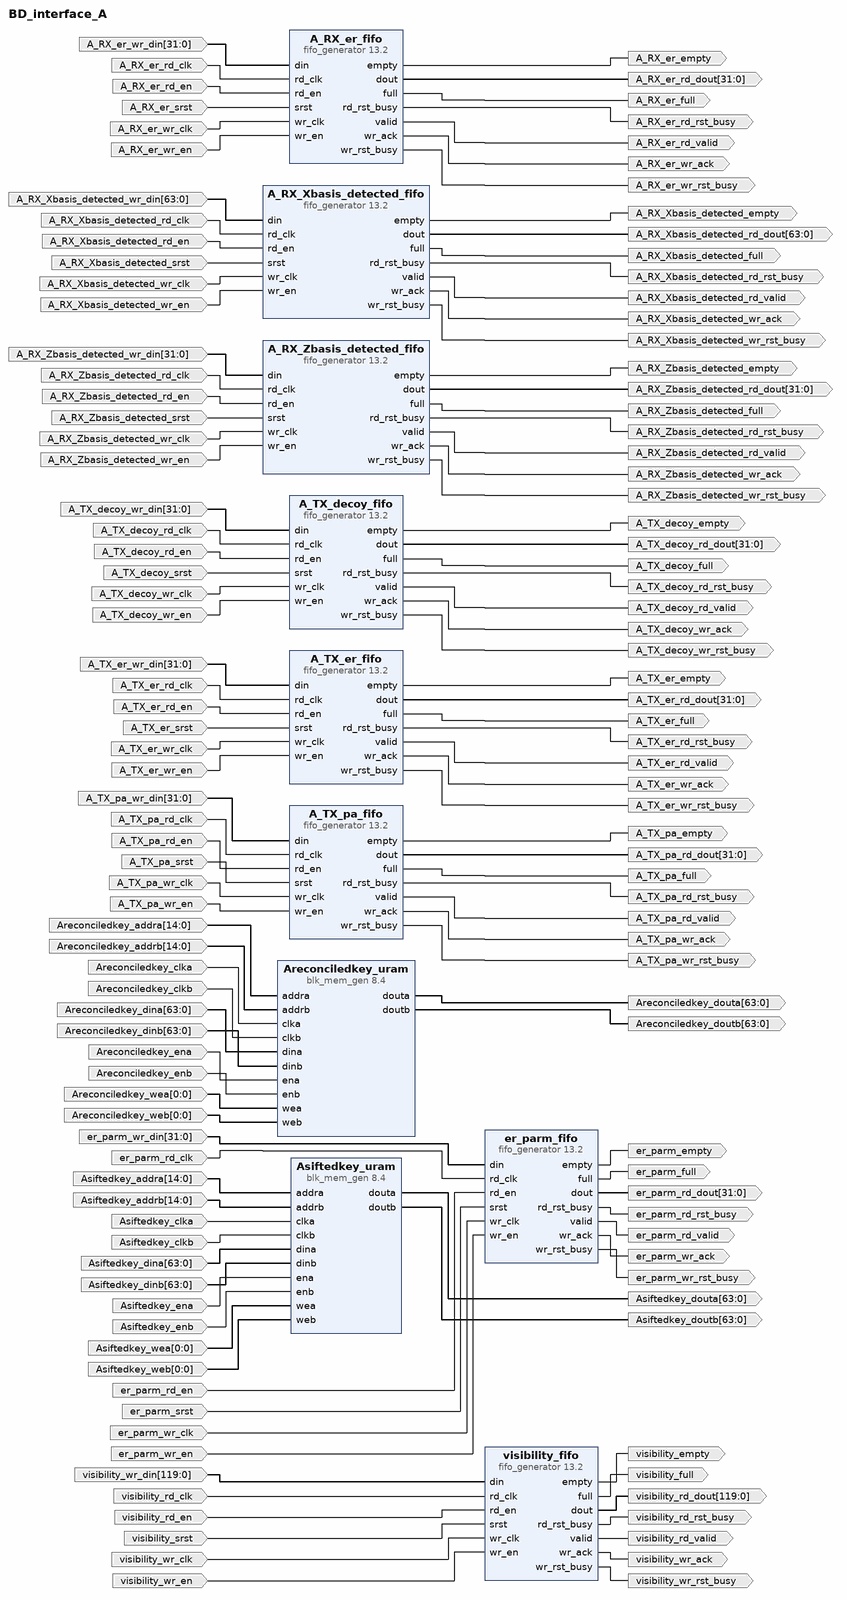
[diagram p0: block diagram of the top level]
# Vivado block design BD_interface_A, xcku5p-ffvb676-2-e, Vivado 2022.1
create_bd_design BD_interface_A

create_bd_port -dir I -type clk A_RX_Xbasis_detected_rd_clk
create_bd_port -dir O A_RX_Xbasis_detected_rd_rst_busy
create_bd_port -dir I A_RX_Xbasis_detected_srst
create_bd_port -dir O A_RX_Xbasis_detected_rd_valid
create_bd_port -dir O A_RX_Xbasis_detected_wr_ack
create_bd_port -dir I -type clk A_RX_Xbasis_detected_wr_clk
create_bd_port -dir O A_RX_Xbasis_detected_wr_rst_busy
create_bd_port -dir O A_RX_Xbasis_detected_full
create_bd_port -dir I A_RX_Xbasis_detected_wr_en
create_bd_port -dir I -from 63 -to 0 A_RX_Xbasis_detected_wr_din
create_bd_port -dir O A_RX_Xbasis_detected_empty
create_bd_port -dir O -from 63 -to 0 A_RX_Xbasis_detected_rd_dout
create_bd_port -dir I A_RX_Xbasis_detected_rd_en
create_bd_port -dir O A_RX_Zbasis_detected_rd_valid
create_bd_port -dir O A_RX_Zbasis_detected_full
create_bd_port -dir I -from 31 -to 0 A_RX_Zbasis_detected_wr_din
create_bd_port -dir O A_RX_Zbasis_detected_wr_rst_busy
create_bd_port -dir O A_RX_Zbasis_detected_rd_rst_busy
create_bd_port -dir I A_RX_Zbasis_detected_wr_en
create_bd_port -dir I A_RX_Zbasis_detected_srst
create_bd_port -dir I -type clk A_RX_Zbasis_detected_wr_clk
create_bd_port -dir I -type clk A_RX_Zbasis_detected_rd_clk
create_bd_port -dir O A_RX_Zbasis_detected_empty
create_bd_port -dir O -from 31 -to 0 A_RX_Zbasis_detected_rd_dout
create_bd_port -dir I A_RX_Zbasis_detected_rd_en
create_bd_port -dir O A_RX_Zbasis_detected_wr_ack
create_bd_port -dir I -type clk A_RX_er_wr_clk
create_bd_port -dir I A_RX_er_srst
create_bd_port -dir O A_RX_er_rd_rst_busy
create_bd_port -dir I A_RX_er_wr_en
create_bd_port -dir I -from 31 -to 0 A_RX_er_wr_din
create_bd_port -dir O A_RX_er_wr_rst_busy
create_bd_port -dir O A_RX_er_rd_valid
create_bd_port -dir O A_RX_er_full
create_bd_port -dir I A_RX_er_rd_en
create_bd_port -dir O -from 31 -to 0 A_RX_er_rd_dout
create_bd_port -dir O A_RX_er_empty
create_bd_port -dir I -type clk A_RX_er_rd_clk
create_bd_port -dir O A_RX_er_wr_ack
create_bd_port -dir I A_TX_decoy_wr_en
create_bd_port -dir I -from 31 -to 0 A_TX_decoy_wr_din
create_bd_port -dir O A_TX_decoy_full
create_bd_port -dir I A_TX_decoy_rd_en
create_bd_port -dir O -from 31 -to 0 A_TX_decoy_rd_dout
create_bd_port -dir O A_TX_decoy_empty
create_bd_port -dir I -type clk A_TX_decoy_rd_clk
create_bd_port -dir I -type clk A_TX_decoy_wr_clk
create_bd_port -dir I A_TX_decoy_srst
create_bd_port -dir O A_TX_decoy_rd_rst_busy
create_bd_port -dir O A_TX_decoy_wr_rst_busy
create_bd_port -dir O A_TX_decoy_rd_valid
create_bd_port -dir O A_TX_decoy_wr_ack
create_bd_port -dir I A_TX_er_rd_en
create_bd_port -dir O -from 31 -to 0 A_TX_er_rd_dout
create_bd_port -dir O A_TX_er_wr_rst_busy
create_bd_port -dir O A_TX_er_rd_valid
create_bd_port -dir I A_TX_er_wr_en
create_bd_port -dir I -from 31 -to 0 A_TX_er_wr_din
create_bd_port -dir O A_TX_er_rd_rst_busy
create_bd_port -dir I -type clk A_TX_er_wr_clk
create_bd_port -dir I A_TX_er_srst
create_bd_port -dir O A_TX_er_wr_ack
create_bd_port -dir I -type clk A_TX_er_rd_clk
create_bd_port -dir O A_TX_er_empty
create_bd_port -dir O A_TX_er_full
create_bd_port -dir O A_TX_pa_wr_rst_busy
create_bd_port -dir O A_TX_pa_full
create_bd_port -dir I A_TX_pa_wr_en
create_bd_port -dir O A_TX_pa_rd_rst_busy
create_bd_port -dir I -from 31 -to 0 A_TX_pa_wr_din
create_bd_port -dir O A_TX_pa_empty
create_bd_port -dir I A_TX_pa_rd_en
create_bd_port -dir O -from 31 -to 0 A_TX_pa_rd_dout
create_bd_port -dir I -type clk A_TX_pa_wr_clk
create_bd_port -dir I A_TX_pa_srst
create_bd_port -dir O A_TX_pa_wr_ack
create_bd_port -dir I -type clk A_TX_pa_rd_clk
create_bd_port -dir O A_TX_pa_rd_valid
create_bd_port -dir I -type clk Areconciledkey_clka
create_bd_port -dir I -from 63 -to 0 Areconciledkey_dina
create_bd_port -dir I Areconciledkey_enb
create_bd_port -dir I -from 0 -to 0 Areconciledkey_web
create_bd_port -dir I -from 14 -to 0 Areconciledkey_addrb
create_bd_port -dir O -from 63 -to 0 Areconciledkey_douta
create_bd_port -dir I -type clk Areconciledkey_clkb
create_bd_port -dir I -from 63 -to 0 Areconciledkey_dinb
create_bd_port -dir I Areconciledkey_ena
create_bd_port -dir I -from 0 -to 0 Areconciledkey_wea
create_bd_port -dir O -from 63 -to 0 Areconciledkey_doutb
create_bd_port -dir I -from 14 -to 0 Areconciledkey_addra
create_bd_port -dir I Asiftedkey_enb
create_bd_port -dir I -from 14 -to 0 Asiftedkey_addra
create_bd_port -dir I -type clk Asiftedkey_clka
create_bd_port -dir I -from 63 -to 0 Asiftedkey_dina
create_bd_port -dir I -from 14 -to 0 Asiftedkey_addrb
create_bd_port -dir I -type clk Asiftedkey_clkb
create_bd_port -dir I -from 63 -to 0 Asiftedkey_dinb
create_bd_port -dir O -from 63 -to 0 Asiftedkey_doutb
create_bd_port -dir O -from 63 -to 0 Asiftedkey_douta
create_bd_port -dir I Asiftedkey_ena
create_bd_port -dir I -from 0 -to 0 Asiftedkey_wea
create_bd_port -dir I -from 0 -to 0 Asiftedkey_web
create_bd_port -dir I -type clk visibility_wr_clk
create_bd_port -dir I visibility_srst
create_bd_port -dir I visibility_rd_en
create_bd_port -dir O -from 119 -to 0 visibility_rd_dout
create_bd_port -dir O visibility_empty
create_bd_port -dir I visibility_wr_en
create_bd_port -dir I -from 119 -to 0 visibility_wr_din
create_bd_port -dir O visibility_rd_rst_busy
create_bd_port -dir O visibility_wr_rst_busy
create_bd_port -dir O visibility_rd_valid
create_bd_port -dir O visibility_wr_ack
create_bd_port -dir I -type clk visibility_rd_clk
create_bd_port -dir O visibility_full
create_bd_port -dir O er_parm_wr_ack
create_bd_port -dir I er_parm_srst
create_bd_port -dir O er_parm_empty
create_bd_port -dir I -type clk er_parm_wr_clk
create_bd_port -dir O er_parm_rd_rst_busy
create_bd_port -dir O er_parm_rd_valid
create_bd_port -dir O er_parm_wr_rst_busy
create_bd_port -dir I -from 31 -to 0 er_parm_wr_din
create_bd_port -dir I er_parm_wr_en
create_bd_port -dir O -from 31 -to 0 er_parm_rd_dout
create_bd_port -dir I -type clk er_parm_rd_clk
create_bd_port -dir I er_parm_rd_en
create_bd_port -dir O er_parm_full

create_bd_cell -type ip -vlnv xilinx.com:ip:fifo_generator:13.2 A_RX_Zbasis_detected_fifo
set_property -dict [list \
  CONFIG.Fifo_Implementation Independent_Clocks_Builtin_FIFO \
  CONFIG.Input_Data_Width 32 \
  CONFIG.Input_Depth 32768 \
  CONFIG.Performance_Options First_Word_Fall_Through \
  CONFIG.Read_Clock_Frequency 125 \
  CONFIG.Valid_Flag true \
  CONFIG.Write_Acknowledge_Flag true \
  CONFIG.Write_Clock_Frequency 125 \
  CONFIG.enable_low_latency true \
  CONFIG.use_dout_register true \
] [get_bd_cells A_RX_Zbasis_detected_fifo]
create_bd_cell -type ip -vlnv xilinx.com:ip:fifo_generator:13.2 A_RX_Xbasis_detected_fifo
set_property -dict [list \
  CONFIG.Fifo_Implementation Independent_Clocks_Builtin_FIFO \
  CONFIG.Input_Data_Width 64 \
  CONFIG.Input_Depth 32768 \
  CONFIG.Performance_Options First_Word_Fall_Through \
  CONFIG.Read_Clock_Frequency 125 \
  CONFIG.Valid_Flag true \
  CONFIG.Write_Acknowledge_Flag true \
  CONFIG.Write_Clock_Frequency 125 \
  CONFIG.enable_low_latency true \
  CONFIG.use_dout_register true \
] [get_bd_cells A_RX_Xbasis_detected_fifo]
create_bd_cell -type ip -vlnv xilinx.com:ip:fifo_generator:13.2 A_RX_er_fifo
set_property -dict [list \
  CONFIG.Fifo_Implementation Independent_Clocks_Builtin_FIFO \
  CONFIG.Input_Data_Width 32 \
  CONFIG.Input_Depth 2048 \
  CONFIG.Performance_Options First_Word_Fall_Through \
  CONFIG.Read_Clock_Frequency 125 \
  CONFIG.Valid_Flag true \
  CONFIG.Write_Acknowledge_Flag true \
  CONFIG.Write_Clock_Frequency 125 \
  CONFIG.enable_low_latency true \
  CONFIG.use_dout_register true \
] [get_bd_cells A_RX_er_fifo]
create_bd_cell -type ip -vlnv xilinx.com:ip:fifo_generator:13.2 A_TX_decoy_fifo
set_property -dict [list \
  CONFIG.Fifo_Implementation Independent_Clocks_Builtin_FIFO \
  CONFIG.Input_Data_Width 32 \
  CONFIG.Input_Depth 2048 \
  CONFIG.Performance_Options First_Word_Fall_Through \
  CONFIG.Read_Clock_Frequency 125 \
  CONFIG.Valid_Flag true \
  CONFIG.Write_Acknowledge_Flag true \
  CONFIG.Write_Clock_Frequency 125 \
  CONFIG.enable_low_latency true \
  CONFIG.use_dout_register true \
] [get_bd_cells A_TX_decoy_fifo]
create_bd_cell -type ip -vlnv xilinx.com:ip:fifo_generator:13.2 A_TX_er_fifo
set_property -dict [list \
  CONFIG.Fifo_Implementation Independent_Clocks_Builtin_FIFO \
  CONFIG.Input_Data_Width 32 \
  CONFIG.Input_Depth 2048 \
  CONFIG.Performance_Options First_Word_Fall_Through \
  CONFIG.Read_Clock_Frequency 125 \
  CONFIG.Valid_Flag true \
  CONFIG.Write_Acknowledge_Flag true \
  CONFIG.Write_Clock_Frequency 125 \
  CONFIG.enable_low_latency true \
  CONFIG.use_dout_register true \
] [get_bd_cells A_TX_er_fifo]
create_bd_cell -type ip -vlnv xilinx.com:ip:fifo_generator:13.2 A_TX_pa_fifo
set_property -dict [list \
  CONFIG.Fifo_Implementation Independent_Clocks_Builtin_FIFO \
  CONFIG.Input_Data_Width 32 \
  CONFIG.Input_Depth 2048 \
  CONFIG.Performance_Options First_Word_Fall_Through \
  CONFIG.Read_Clock_Frequency 125 \
  CONFIG.Valid_Flag true \
  CONFIG.Write_Acknowledge_Flag true \
  CONFIG.Write_Clock_Frequency 125 \
  CONFIG.enable_low_latency true \
  CONFIG.use_dout_register true \
] [get_bd_cells A_TX_pa_fifo]
create_bd_cell -type ip -vlnv xilinx.com:ip:blk_mem_gen:8.4 Asiftedkey_uram
set_property -dict [list \
  CONFIG.Enable_32bit_Address false \
  CONFIG.Memory_Type True_Dual_Port_RAM \
  CONFIG.PRIM_type_to_Implement URAM \
  CONFIG.Port_B_Clock 100 \
  CONFIG.Port_B_Enable_Rate 100 \
  CONFIG.Port_B_Write_Rate 50 \
  CONFIG.Use_Byte_Write_Enable false \
  CONFIG.Use_RSTA_Pin false \
  CONFIG.Write_Depth_A 32768 \
  CONFIG.Write_Width_A 64 \
  CONFIG.use_bram_block Stand_Alone \
] [get_bd_cells Asiftedkey_uram]
create_bd_cell -type ip -vlnv xilinx.com:ip:blk_mem_gen:8.4 Areconciledkey_uram
set_property -dict [list \
  CONFIG.Enable_32bit_Address false \
  CONFIG.Memory_Type True_Dual_Port_RAM \
  CONFIG.PRIM_type_to_Implement URAM \
  CONFIG.Port_B_Clock 100 \
  CONFIG.Port_B_Enable_Rate 100 \
  CONFIG.Port_B_Write_Rate 50 \
  CONFIG.Use_Byte_Write_Enable false \
  CONFIG.Use_RSTA_Pin false \
  CONFIG.Use_RSTB_Pin false \
  CONFIG.Write_Depth_A 32768 \
  CONFIG.Write_Width_A 64 \
  CONFIG.use_bram_block Stand_Alone \
] [get_bd_cells Areconciledkey_uram]
create_bd_cell -type ip -vlnv xilinx.com:ip:fifo_generator:13.2 visibility_fifo
set_property -dict [list \
  CONFIG.Fifo_Implementation Independent_Clocks_Builtin_FIFO \
  CONFIG.Input_Data_Width 120 \
  CONFIG.Input_Depth 512 \
  CONFIG.Performance_Options First_Word_Fall_Through \
  CONFIG.Read_Clock_Frequency 125 \
  CONFIG.Valid_Flag true \
  CONFIG.Write_Acknowledge_Flag true \
  CONFIG.Write_Clock_Frequency 20 \
] [get_bd_cells visibility_fifo]
create_bd_cell -type ip -vlnv xilinx.com:ip:fifo_generator:13.2 er_parm_fifo
set_property -dict [list \
  CONFIG.Fifo_Implementation Independent_Clocks_Builtin_FIFO \
  CONFIG.Input_Data_Width 32 \
  CONFIG.Input_Depth 512 \
  CONFIG.Performance_Options First_Word_Fall_Through \
  CONFIG.Read_Clock_Frequency 125 \
  CONFIG.Use_Embedded_Registers true \
  CONFIG.Valid_Flag true \
  CONFIG.Write_Acknowledge_Flag true \
  CONFIG.Write_Clock_Frequency 20 \
] [get_bd_cells er_parm_fifo]

# ---- connections ----

connect_bd_net [get_bd_pins A_RX_Xbasis_detected_fifo/dout] [get_bd_ports A_RX_Xbasis_detected_rd_dout]
connect_bd_net [get_bd_pins A_RX_Xbasis_detected_fifo/empty] [get_bd_ports A_RX_Xbasis_detected_empty]
connect_bd_net [get_bd_pins A_RX_Xbasis_detected_fifo/full] [get_bd_ports A_RX_Xbasis_detected_full]
connect_bd_net [get_bd_pins A_RX_Xbasis_detected_fifo/rd_rst_busy] [get_bd_ports A_RX_Xbasis_detected_rd_rst_busy]
connect_bd_net [get_bd_pins A_RX_Xbasis_detected_fifo/valid] [get_bd_ports A_RX_Xbasis_detected_rd_valid]
connect_bd_net [get_bd_pins A_RX_Xbasis_detected_fifo/wr_ack] [get_bd_ports A_RX_Xbasis_detected_wr_ack]
connect_bd_net [get_bd_pins A_RX_Xbasis_detected_fifo/wr_rst_busy] [get_bd_ports A_RX_Xbasis_detected_wr_rst_busy]
connect_bd_net [get_bd_pins A_RX_Zbasis_detected_fifo/dout] [get_bd_ports A_RX_Zbasis_detected_rd_dout]
connect_bd_net [get_bd_pins A_RX_Zbasis_detected_fifo/empty] [get_bd_ports A_RX_Zbasis_detected_empty]
connect_bd_net [get_bd_pins A_RX_Zbasis_detected_fifo/full] [get_bd_ports A_RX_Zbasis_detected_full]
connect_bd_net [get_bd_pins A_RX_Zbasis_detected_fifo/rd_rst_busy] [get_bd_ports A_RX_Zbasis_detected_rd_rst_busy]
connect_bd_net [get_bd_pins A_RX_Zbasis_detected_fifo/valid] [get_bd_ports A_RX_Zbasis_detected_rd_valid]
connect_bd_net [get_bd_pins A_RX_Zbasis_detected_fifo/wr_ack] [get_bd_ports A_RX_Zbasis_detected_wr_ack]
connect_bd_net [get_bd_pins A_RX_Zbasis_detected_fifo/wr_rst_busy] [get_bd_ports A_RX_Zbasis_detected_wr_rst_busy]
connect_bd_net [get_bd_pins A_RX_er_fifo/dout] [get_bd_ports A_RX_er_rd_dout]
connect_bd_net [get_bd_pins A_RX_er_fifo/empty] [get_bd_ports A_RX_er_empty]
connect_bd_net [get_bd_pins A_RX_er_fifo/full] [get_bd_ports A_RX_er_full]
connect_bd_net [get_bd_pins A_RX_er_fifo/rd_rst_busy] [get_bd_ports A_RX_er_rd_rst_busy]
connect_bd_net [get_bd_pins A_RX_er_fifo/valid] [get_bd_ports A_RX_er_rd_valid]
connect_bd_net [get_bd_pins A_RX_er_fifo/wr_ack] [get_bd_ports A_RX_er_wr_ack]
connect_bd_net [get_bd_pins A_RX_er_fifo/wr_rst_busy] [get_bd_ports A_RX_er_wr_rst_busy]
connect_bd_net [get_bd_pins A_TX_decoy_fifo/dout] [get_bd_ports A_TX_decoy_rd_dout]
connect_bd_net [get_bd_pins A_TX_decoy_fifo/empty] [get_bd_ports A_TX_decoy_empty]
connect_bd_net [get_bd_pins A_TX_decoy_fifo/full] [get_bd_ports A_TX_decoy_full]
connect_bd_net [get_bd_pins A_TX_decoy_fifo/rd_rst_busy] [get_bd_ports A_TX_decoy_rd_rst_busy]
connect_bd_net [get_bd_pins A_TX_decoy_fifo/valid] [get_bd_ports A_TX_decoy_rd_valid]
connect_bd_net [get_bd_pins A_TX_decoy_fifo/wr_ack] [get_bd_ports A_TX_decoy_wr_ack]
connect_bd_net [get_bd_pins A_TX_decoy_fifo/wr_rst_busy] [get_bd_ports A_TX_decoy_wr_rst_busy]
connect_bd_net [get_bd_pins A_TX_er_fifo/dout] [get_bd_ports A_TX_er_rd_dout]
connect_bd_net [get_bd_pins A_TX_er_fifo/empty] [get_bd_ports A_TX_er_empty]
connect_bd_net [get_bd_pins A_TX_er_fifo/full] [get_bd_ports A_TX_er_full]
connect_bd_net [get_bd_pins A_TX_er_fifo/rd_rst_busy] [get_bd_ports A_TX_er_rd_rst_busy]
connect_bd_net [get_bd_pins A_TX_er_fifo/valid] [get_bd_ports A_TX_er_rd_valid]
connect_bd_net [get_bd_pins A_TX_er_fifo/wr_ack] [get_bd_ports A_TX_er_wr_ack]
connect_bd_net [get_bd_pins A_TX_er_fifo/wr_rst_busy] [get_bd_ports A_TX_er_wr_rst_busy]
connect_bd_net [get_bd_pins A_TX_pa_fifo/dout] [get_bd_ports A_TX_pa_rd_dout]
connect_bd_net [get_bd_pins A_TX_pa_fifo/empty] [get_bd_ports A_TX_pa_empty]
connect_bd_net [get_bd_pins A_TX_pa_fifo/full] [get_bd_ports A_TX_pa_full]
connect_bd_net [get_bd_pins A_TX_pa_fifo/rd_rst_busy] [get_bd_ports A_TX_pa_rd_rst_busy]
connect_bd_net [get_bd_pins A_TX_pa_fifo/valid] [get_bd_ports A_TX_pa_rd_valid]
connect_bd_net [get_bd_pins A_TX_pa_fifo/wr_ack] [get_bd_ports A_TX_pa_wr_ack]
connect_bd_net [get_bd_pins A_TX_pa_fifo/wr_rst_busy] [get_bd_ports A_TX_pa_wr_rst_busy]
connect_bd_net [get_bd_pins Areconciledkey_uram/douta] [get_bd_ports Areconciledkey_douta]
connect_bd_net [get_bd_pins Areconciledkey_uram/doutb] [get_bd_ports Areconciledkey_doutb]
connect_bd_net [get_bd_pins Asiftedkey_uram/douta] [get_bd_ports Asiftedkey_douta]
connect_bd_net [get_bd_pins Asiftedkey_uram/doutb] [get_bd_ports Asiftedkey_doutb]
connect_bd_net -net addra_0_1 [get_bd_ports Areconciledkey_addra] [get_bd_pins Areconciledkey_uram/addra]
connect_bd_net -net addra_0_2 [get_bd_ports Asiftedkey_addra] [get_bd_pins Asiftedkey_uram/addra]
connect_bd_net -net addrb_0_1 [get_bd_ports Areconciledkey_addrb] [get_bd_pins Areconciledkey_uram/addrb]
connect_bd_net -net addrb_0_2 [get_bd_ports Asiftedkey_addrb] [get_bd_pins Asiftedkey_uram/addrb]
connect_bd_net -net clka_0_1 [get_bd_ports Areconciledkey_clka] [get_bd_pins Areconciledkey_uram/clka]
connect_bd_net -net clka_0_2 [get_bd_ports Asiftedkey_clka] [get_bd_pins Asiftedkey_uram/clka]
connect_bd_net -net clkb_0_1 [get_bd_ports Areconciledkey_clkb] [get_bd_pins Areconciledkey_uram/clkb]
connect_bd_net -net clkb_0_2 [get_bd_ports Asiftedkey_clkb] [get_bd_pins Asiftedkey_uram/clkb]
connect_bd_net -net din_0_1 [get_bd_ports A_RX_Xbasis_detected_wr_din] [get_bd_pins A_RX_Xbasis_detected_fifo/din]
connect_bd_net -net din_0_2 [get_bd_ports A_RX_Zbasis_detected_wr_din] [get_bd_pins A_RX_Zbasis_detected_fifo/din]
connect_bd_net -net din_0_3 [get_bd_ports A_RX_er_wr_din] [get_bd_pins A_RX_er_fifo/din]
connect_bd_net -net din_0_4 [get_bd_ports A_TX_decoy_wr_din] [get_bd_pins A_TX_decoy_fifo/din]
connect_bd_net -net din_0_5 [get_bd_ports A_TX_er_wr_din] [get_bd_pins A_TX_er_fifo/din]
connect_bd_net -net din_0_6 [get_bd_ports A_TX_pa_wr_din] [get_bd_pins A_TX_pa_fifo/din]
connect_bd_net -net din_0_7 [get_bd_ports visibility_wr_din] [get_bd_pins visibility_fifo/din]
connect_bd_net -net din_0_8 [get_bd_ports er_parm_wr_din] [get_bd_pins er_parm_fifo/din]
connect_bd_net -net dina_0_1 [get_bd_ports Areconciledkey_dina] [get_bd_pins Areconciledkey_uram/dina]
connect_bd_net -net dina_0_2 [get_bd_ports Asiftedkey_dina] [get_bd_pins Asiftedkey_uram/dina]
connect_bd_net -net dinb_0_1 [get_bd_ports Areconciledkey_dinb] [get_bd_pins Areconciledkey_uram/dinb]
connect_bd_net -net dinb_0_2 [get_bd_ports Asiftedkey_dinb] [get_bd_pins Asiftedkey_uram/dinb]
connect_bd_net -net ena_0_1 [get_bd_ports Areconciledkey_ena] [get_bd_pins Areconciledkey_uram/ena]
connect_bd_net -net ena_0_2 [get_bd_ports Asiftedkey_ena] [get_bd_pins Asiftedkey_uram/ena]
connect_bd_net -net enb_0_1 [get_bd_ports Areconciledkey_enb] [get_bd_pins Areconciledkey_uram/enb]
connect_bd_net -net enb_0_2 [get_bd_ports Asiftedkey_enb] [get_bd_pins Asiftedkey_uram/enb]
connect_bd_net [get_bd_pins er_parm_fifo/dout] [get_bd_ports er_parm_rd_dout]
connect_bd_net [get_bd_pins er_parm_fifo/empty] [get_bd_ports er_parm_empty]
connect_bd_net [get_bd_pins er_parm_fifo/full] [get_bd_ports er_parm_full]
connect_bd_net [get_bd_pins er_parm_fifo/rd_rst_busy] [get_bd_ports er_parm_rd_rst_busy]
connect_bd_net [get_bd_pins er_parm_fifo/valid] [get_bd_ports er_parm_rd_valid]
connect_bd_net [get_bd_pins er_parm_fifo/wr_ack] [get_bd_ports er_parm_wr_ack]
connect_bd_net [get_bd_pins er_parm_fifo/wr_rst_busy] [get_bd_ports er_parm_wr_rst_busy]
connect_bd_net -net rd_clk_0_1 [get_bd_ports A_RX_Xbasis_detected_rd_clk] [get_bd_pins A_RX_Xbasis_detected_fifo/rd_clk]
connect_bd_net -net rd_clk_0_2 [get_bd_ports A_RX_Zbasis_detected_rd_clk] [get_bd_pins A_RX_Zbasis_detected_fifo/rd_clk]
connect_bd_net -net rd_clk_0_3 [get_bd_ports A_RX_er_rd_clk] [get_bd_pins A_RX_er_fifo/rd_clk]
connect_bd_net -net rd_clk_0_4 [get_bd_ports A_TX_decoy_rd_clk] [get_bd_pins A_TX_decoy_fifo/rd_clk]
connect_bd_net -net rd_clk_0_5 [get_bd_ports A_TX_er_rd_clk] [get_bd_pins A_TX_er_fifo/rd_clk]
connect_bd_net -net rd_clk_0_6 [get_bd_ports A_TX_pa_rd_clk] [get_bd_pins A_TX_pa_fifo/rd_clk]
connect_bd_net -net rd_clk_0_7 [get_bd_ports visibility_rd_clk] [get_bd_pins visibility_fifo/rd_clk]
connect_bd_net -net rd_clk_0_8 [get_bd_ports er_parm_rd_clk] [get_bd_pins er_parm_fifo/rd_clk]
connect_bd_net -net rd_en_0_1 [get_bd_ports A_RX_Xbasis_detected_rd_en] [get_bd_pins A_RX_Xbasis_detected_fifo/rd_en]
connect_bd_net -net rd_en_0_2 [get_bd_ports A_RX_Zbasis_detected_rd_en] [get_bd_pins A_RX_Zbasis_detected_fifo/rd_en]
connect_bd_net -net rd_en_0_3 [get_bd_ports A_RX_er_rd_en] [get_bd_pins A_RX_er_fifo/rd_en]
connect_bd_net -net rd_en_0_4 [get_bd_ports A_TX_decoy_rd_en] [get_bd_pins A_TX_decoy_fifo/rd_en]
connect_bd_net -net rd_en_0_5 [get_bd_ports A_TX_er_rd_en] [get_bd_pins A_TX_er_fifo/rd_en]
connect_bd_net -net rd_en_0_6 [get_bd_ports A_TX_pa_rd_en] [get_bd_pins A_TX_pa_fifo/rd_en]
connect_bd_net -net rd_en_0_7 [get_bd_ports visibility_rd_en] [get_bd_pins visibility_fifo/rd_en]
connect_bd_net -net rd_en_0_8 [get_bd_ports er_parm_rd_en] [get_bd_pins er_parm_fifo/rd_en]
connect_bd_net -net srst_0_1 [get_bd_ports A_RX_Xbasis_detected_srst] [get_bd_pins A_RX_Xbasis_detected_fifo/srst]
connect_bd_net -net srst_0_2 [get_bd_ports A_RX_Zbasis_detected_srst] [get_bd_pins A_RX_Zbasis_detected_fifo/srst]
connect_bd_net -net srst_0_3 [get_bd_ports A_RX_er_srst] [get_bd_pins A_RX_er_fifo/srst]
connect_bd_net -net srst_0_4 [get_bd_ports A_TX_decoy_srst] [get_bd_pins A_TX_decoy_fifo/srst]
connect_bd_net -net srst_0_5 [get_bd_ports A_TX_er_srst] [get_bd_pins A_TX_er_fifo/srst]
connect_bd_net -net srst_0_6 [get_bd_ports A_TX_pa_srst] [get_bd_pins A_TX_pa_fifo/srst]
connect_bd_net -net srst_0_7 [get_bd_ports visibility_srst] [get_bd_pins visibility_fifo/srst]
connect_bd_net -net srst_0_8 [get_bd_ports er_parm_srst] [get_bd_pins er_parm_fifo/srst]
connect_bd_net [get_bd_pins visibility_fifo/dout] [get_bd_ports visibility_rd_dout]
connect_bd_net [get_bd_pins visibility_fifo/empty] [get_bd_ports visibility_empty]
connect_bd_net [get_bd_pins visibility_fifo/full] [get_bd_ports visibility_full]
connect_bd_net [get_bd_pins visibility_fifo/rd_rst_busy] [get_bd_ports visibility_rd_rst_busy]
connect_bd_net [get_bd_pins visibility_fifo/valid] [get_bd_ports visibility_rd_valid]
connect_bd_net [get_bd_pins visibility_fifo/wr_ack] [get_bd_ports visibility_wr_ack]
connect_bd_net [get_bd_pins visibility_fifo/wr_rst_busy] [get_bd_ports visibility_wr_rst_busy]
connect_bd_net -net wea_0_1 [get_bd_ports Areconciledkey_wea] [get_bd_pins Areconciledkey_uram/wea]
connect_bd_net -net wea_0_2 [get_bd_ports Asiftedkey_wea] [get_bd_pins Asiftedkey_uram/wea]
connect_bd_net -net web_0_1 [get_bd_ports Areconciledkey_web] [get_bd_pins Areconciledkey_uram/web]
connect_bd_net -net web_0_2 [get_bd_ports Asiftedkey_web] [get_bd_pins Asiftedkey_uram/web]
connect_bd_net -net wr_clk_0_1 [get_bd_ports A_RX_Xbasis_detected_wr_clk] [get_bd_pins A_RX_Xbasis_detected_fifo/wr_clk]
connect_bd_net -net wr_clk_0_2 [get_bd_ports A_RX_Zbasis_detected_wr_clk] [get_bd_pins A_RX_Zbasis_detected_fifo/wr_clk]
connect_bd_net -net wr_clk_0_3 [get_bd_ports A_RX_er_wr_clk] [get_bd_pins A_RX_er_fifo/wr_clk]
connect_bd_net -net wr_clk_0_4 [get_bd_ports A_TX_decoy_wr_clk] [get_bd_pins A_TX_decoy_fifo/wr_clk]
connect_bd_net -net wr_clk_0_5 [get_bd_ports A_TX_er_wr_clk] [get_bd_pins A_TX_er_fifo/wr_clk]
connect_bd_net -net wr_clk_0_6 [get_bd_ports A_TX_pa_wr_clk] [get_bd_pins A_TX_pa_fifo/wr_clk]
connect_bd_net -net wr_clk_0_7 [get_bd_ports visibility_wr_clk] [get_bd_pins visibility_fifo/wr_clk]
connect_bd_net -net wr_clk_0_8 [get_bd_ports er_parm_wr_clk] [get_bd_pins er_parm_fifo/wr_clk]
connect_bd_net -net wr_en_0_1 [get_bd_ports A_RX_Xbasis_detected_wr_en] [get_bd_pins A_RX_Xbasis_detected_fifo/wr_en]
connect_bd_net -net wr_en_0_2 [get_bd_ports A_RX_Zbasis_detected_wr_en] [get_bd_pins A_RX_Zbasis_detected_fifo/wr_en]
connect_bd_net -net wr_en_0_3 [get_bd_ports A_RX_er_wr_en] [get_bd_pins A_RX_er_fifo/wr_en]
connect_bd_net -net wr_en_0_4 [get_bd_ports A_TX_decoy_wr_en] [get_bd_pins A_TX_decoy_fifo/wr_en]
connect_bd_net -net wr_en_0_5 [get_bd_ports A_TX_er_wr_en] [get_bd_pins A_TX_er_fifo/wr_en]
connect_bd_net -net wr_en_0_6 [get_bd_ports A_TX_pa_wr_en] [get_bd_pins A_TX_pa_fifo/wr_en]
connect_bd_net -net wr_en_0_7 [get_bd_ports visibility_wr_en] [get_bd_pins visibility_fifo/wr_en]
connect_bd_net -net wr_en_0_8 [get_bd_ports er_parm_wr_en] [get_bd_pins er_parm_fifo/wr_en]

validate_bd_design
save_bd_design
